# Altium schematic sheet RS485.SchDoc
size A4
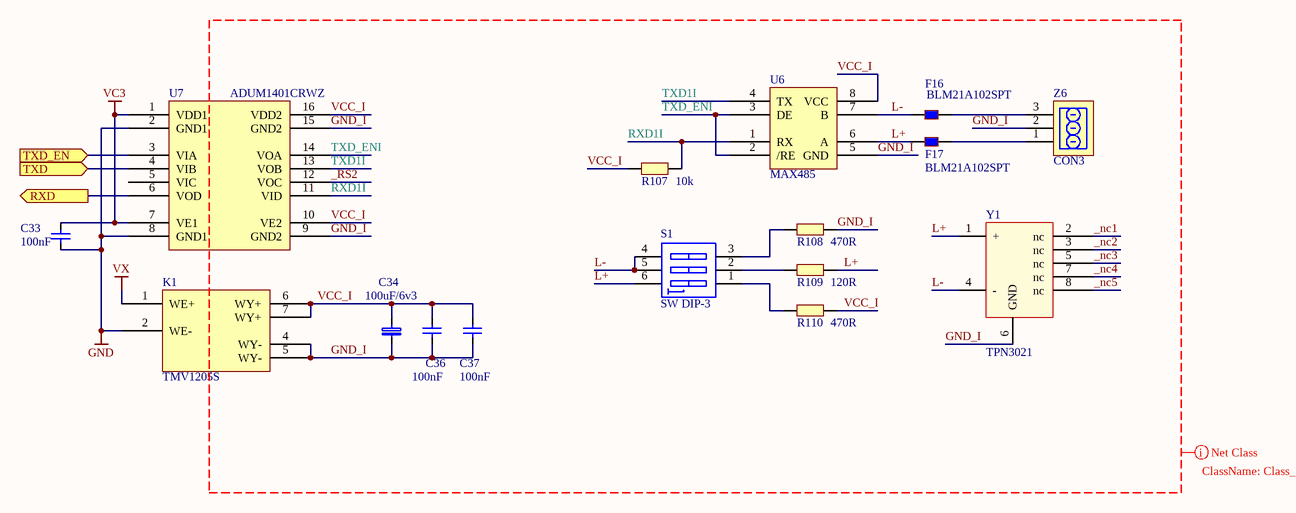
[diagram p0: RS485.SchDoc]

## Parts
C33  100nF  [0603C]
C34  100uF/6v3  [CAP_C]
C36  100nF  [0603C]
C37  100nF  [0603C]
F16  BLM21A102SPT  [0603L]
F17  BLM21A102SPT  [0603L]
K1  TMV1205S  [DCDC-S1_D]
R107  10k  [0603R]
R108  470R  [1206]
R109  120R  [1206]
R110  470R  [1206]
S1  SW DIP-3  [DIP-6]
U6  MAX485  [SO8]
U7  ADUM1401CRWZ  [SMD16B]
Y1  TPN3021  [SO8]
Z6  CON3  [ARC-3-3.5-TYCO-1]

## Ports
RXD (out), TXD (in), TXD_EN (in)

## Nets
GND: C33.2 K1.2(WE-) U7.2(GND1) U7.8(GND1)
VC3: C33.1 U7.1(VDD1) U7.7(VE1)
VX: K1.1(WE+)
_nc1: Y1.2(nc)
_nc2: Y1.3(nc)
_nc3: Y1.5(nc)
_nc4: Y1.7(nc)
_nc5: Y1.8(nc)
_RS2: U7.12(VOC)
GND_I: C34.1 C36.2 C37.2 K1.4(WY-) K1.5(WY-) R108.2 U6.5(GND) U7.9(GND2) U7.15(GND2) Y1.6(GND) Z6.2
L+: F17.1 R109.2 S1.6(B1) U6.6(A) Y1.1(+)
L-: F16.1 S1.4(B3) S1.5(B2) U6.7(B) Y1.4(-)
RXD: U7.6(VOD) ; port RXD
RXD1I: R107.2 U6.1(RX) U7.11(VID)
TXD: U7.4(VIB) ; port TXD
TXD1I: U6.4(TX) U7.13(VOB)
TXD_EN: U7.3(VIA) ; port TXD_EN
TXD_ENI: U6.2(/RE) U6.3(DE) U7.14(VOA)
VCC_I: C34.2 C36.1 C37.1 K1.6(WY+) K1.7(WY+) R107.1 R110.2 U6.8(VCC) U7.10(VE2) U7.16(VDD2)
NetF16_2: F16.2 Z6.3
NetF17_2: F17.2 Z6.1
NetR108_1: R108.1 S1.3(A3)
NetR109_1: R109.1 S1.2(A2)
NetR110_1: R110.1 S1.1(A1)

Not connected (* = marked no-connect by the designer): U7 5(VIC)

## Layout directives
net class Class_RS485: _nc1, _nc2, _nc3, _nc4, _nc5, _RS2, GND_I, L+, L-, RXD1I, TXD1I, TXD_ENI, VCC_I

## Library data of the parts
C33 C36 C37 = CAP
C34 = CAP_TANTAL_SMD: KONDENSATOR ELEKTROLITYCZNY TANTALOWY SMD
F16 F17 = KORALIK: Koralik ferrytowy
K1 = NMV0505S_D
R107-R110 = RES3
S1 = SW DIP-3: DIP Switch, 3 Position, SPST; Published: 24-Mar-1999; LatestRevisionDate: 17-Jul-2002; LatestRevisionNote: Re-released for DXP Platform.; PackageReference: DIP-6; Publisher: Altium Limited; Code_JEDEC: MO-001-AM
U6 = MAX485_1
U7 = ADUM1401
Z6 = ZL-3